# Altium schematic sheet SVPXFMC_Carrier_3U.SchDoc: SVPXFMC Carrier 3U
size 420 x 297 mm; CheckedBy: \; Author: G.Kasprowicz; CompanyName: ISE; DrawnBy: T.Przywozki; Organization: WUT ISE; Address1: Warsaw University of Technology; Address2: Nowowiejska 15/19 00-665 Warsaw; Revision: 1.0.; SheetNumber: 1; SheetTotal: 20; ModifiedBy: -; CheckedDate: -; Title2: Top; DivGrp: ISE; Designer: G.Kasprowicz; Project: SVPXFMC Carrier 3U; ModifiedDate: -; ProjectName: FMC SFP 4
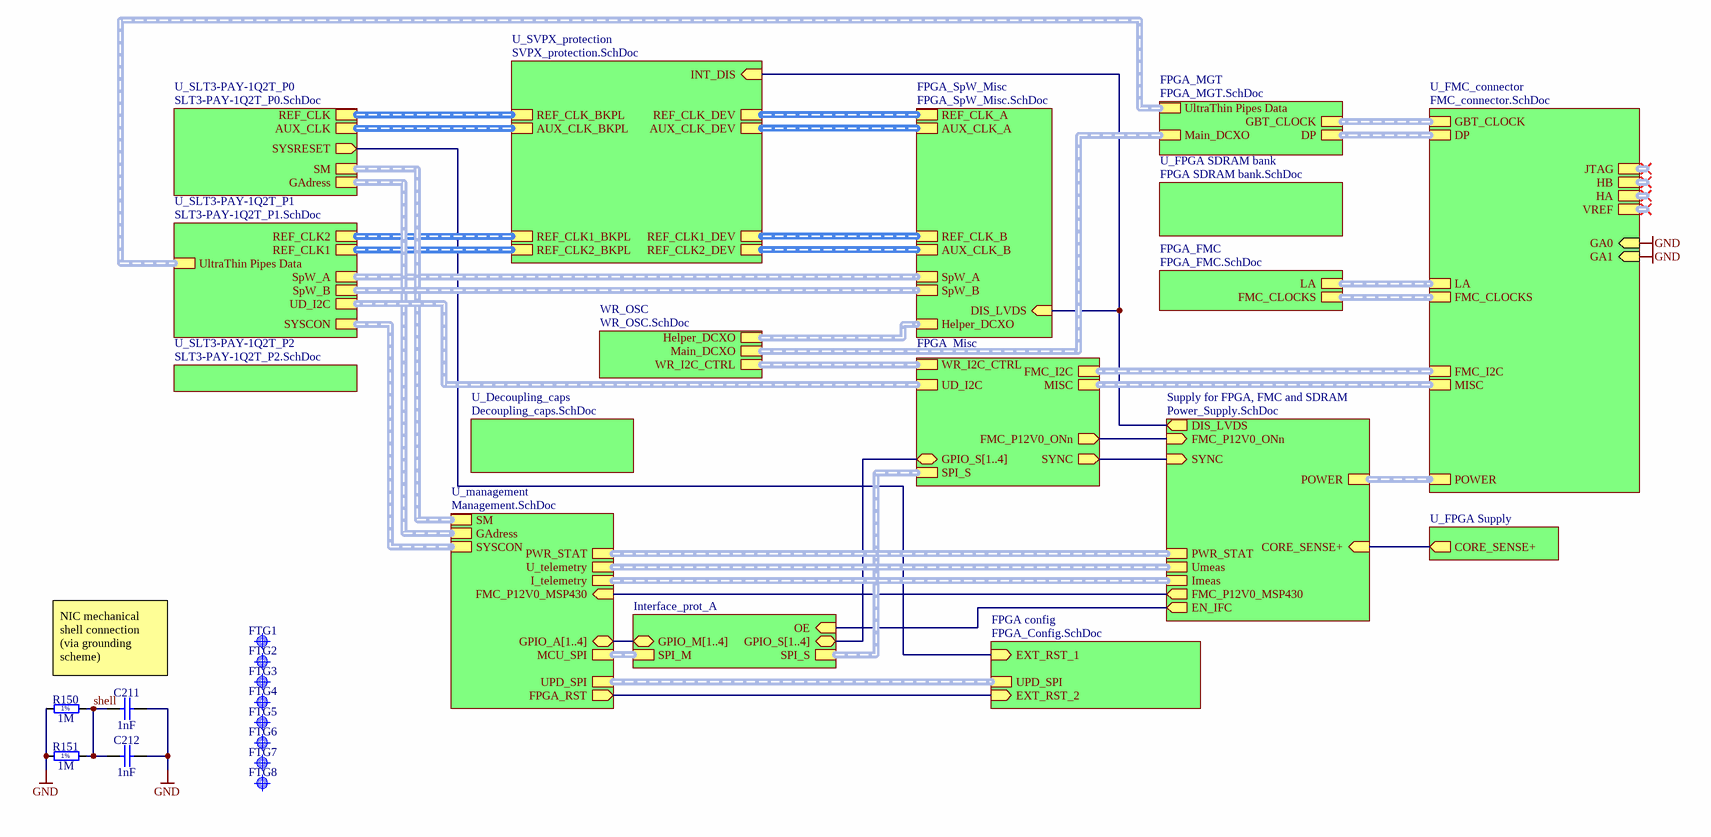
[diagram p0: SVPXFMC_Carrier_3U.SchDoc]

## Parts
C211  1nF  [CAPC1005X55N]
C212  1nF  [CAPC1005X55N]
FTG1  Use only in PCB  [FIDUCIAL_TOP_C100-200]  (value not drawn)
FTG2  Use only in PCB  [FIDUCIAL_TOP_C100-200]  (value not drawn)
FTG3  Use only in PCB  [FIDUCIAL_TOP_C100-200]  (value not drawn)
FTG4  Use only in PCB  [FIDUCIAL_TOP_C100-200]  (value not drawn)
FTG5  Use only in PCB  [FIDUCIAL_TOP_C100-200]  (value not drawn)
FTG6  Use only in PCB  [FIDUCIAL_TOP_C100-200]  (value not drawn)
FTG7  Use only in PCB  [FIDUCIAL_TOP_C100-200]  (value not drawn)
FTG8  Use only in PCB  [FIDUCIAL_TOP_C100-200]  (value not drawn)
R150  1M  [RESC1005X40N]
R151  1M  [RESC1005X40N]

## Sub-sheets
FPGA config = FPGA_Config.SchDoc: UPD_SPI (harness UPD_SPI), EXT_RST_1 (in), EXT_RST_2 (in)
FPGA_FMC = FPGA_FMC.SchDoc: LA (harness FMC_J1_LA), FMC_CLOCKS (harness FMC_CLOCKS)
FPGA_MGT = FPGA_MGT.SchDoc: GBT_CLOCK (harness GBT_CLOCK), DP (harness FMC_J1_DP), Main_DCXO (harness DIFF_CLK), UltraThin Pipes Data (harness UTP_Data)
FPGA_Misc = FPGA_Misc.SchDoc: SYNC (out), GPIO_S[1..4] (bidir), SPI_S (harness SPI), FMC_I2C (harness I2C), MISC (harness MISC), WR_I2C_CTRL (harness WR_I2C_CTRL), FMC_P12V0_ONn (out), UD_I2C (harness I2C)
FPGA_SpW_Misc = FPGA_SpW_Misc.SchDoc: SpW_B (harness SpW), SpW_A (harness SpW), REF_CLK_A (harness CLK), REF_CLK_B (harness CLK), DIS_LVDS (in), AUX_CLK_A (harness CLK), AUX_CLK_B (harness CLK), Helper_DCXO (harness DIFF_CLK)
Interface_prot_A = Interface_Protection.SchDoc: SPI_M (harness SPI), SPI_S (harness SPI), OE (in), GPIO_S[1..4] (bidir), GPIO_M[1..4] (bidir)
Supply for FPGA, FMC and SDRAM = Power_Supply.SchDoc: Imeas (harness Imeas), SYNC (in), POWER (harness FMC_POWER), CORE_SENSE+ (in), FMC_P12V0_ONn (in), PWR_STAT (harness PWR_STAT), Umeas (harness Umeas), DIS_LVDS (out), EN_IFC (out), FMC_P12V0_MSP430 (out)
U_Decoupling_caps = Decoupling_caps.SchDoc: no entries
U_FMC_connector = FMC_connector.SchDoc: DP (harness FMC_J1_DP), LA (harness FMC_J1_LA), HA (harness FMC_J1_HA), HB (harness FMC_J1_HB), MISC (harness MISC), POWER (harness FMC_POWER), JTAG (harness FMC_J1_JTAG), FMC_I2C (harness I2C), FMC_CLOCKS (harness FMC_CLOCKS), VREF (harness FMC_J1_VREF), GA0 (in), GA1 (in), GBT_CLOCK (harness GBT_CLOCK)
U_FPGA SDRAM bank = FPGA SDRAM bank.SchDoc: no entries
U_FPGA Supply = FPGA Supply.SchDoc: CORE_SENSE+ (out)
U_management = Management.SchDoc: MCU_SPI (harness SPI), SM (harness SM), GAdress (harness GAdress), U_telemetry (harness Umeas), I_telemetry (harness Imeas), FPGA_RST (out), UPD_SPI (harness UPD_SPI), SYSCON (harness SYSCON), PWR_STAT (harness PWR_STAT), GPIO_A[1..4] (bidir), FMC_P12V0_MSP430 (in)
U_SLT3-PAY-1Q2T_P0 = SLT3-PAY-1Q2T_P0.SchDoc: AUX_CLK (harness CLK), REF_CLK (harness CLK), GAdress (harness GAdress), SM (harness SM), SYSRESET (out)
U_SLT3-PAY-1Q2T_P1 = SLT3-PAY-1Q2T_P1.SchDoc: SpW_A (harness SpW), SpW_B (harness SpW), REF_CLK1 (harness CLK), REF_CLK2 (harness CLK), SYSCON (harness SYSCON), UD_I2C (harness I2C), UltraThin Pipes Data
U_SLT3-PAY-1Q2T_P2 = SLT3-PAY-1Q2T_P2.SchDoc: no entries
U_SVPX_protection = SVPX_protection.SchDoc: REF_CLK_BKPL (harness CLK), AUX_CLK_BKPL (harness CLK), AUX_CLK_DEV (harness CLK), REF_CLK_DEV (harness CLK), INT_DIS (in), REF_CLK1_BKPL (harness CLK), REF_CLK2_BKPL (harness CLK), REF_CLK1_DEV (harness CLK), REF_CLK2_DEV (harness CLK)
WR_OSC = WR_OSC.SchDoc: WR_I2C_CTRL (harness WR_I2C_CTRL), Main_DCXO (harness DIFF_CLK), Helper_DCXO (harness DIFF_CLK)

## Nets
GND: C211.2 C212.2 R150.1 R151.1 ; sheet U_FMC_connector/GA0, sheet U_FMC_connector/GA1
shell: C211.1 C212.1 R150.2 R151.2
(unnamed): sheet Interface_prot_A/OE, sheet Supply for FPGA, FMC and SDRAM/EN_IFC
(unnamed): sheet FPGA_Misc/SYNC, sheet Supply for FPGA, FMC and SDRAM/SYNC
(unnamed): sheet FPGA_Misc/FMC_P12V0_ONn, sheet Supply for FPGA, FMC and SDRAM/FMC_P12V0_ONn
(unnamed): sheet Supply for FPGA, FMC and SDRAM/CORE_SENSE+, sheet U_FPGA Supply/CORE_SENSE+
(unnamed): sheet Supply for FPGA, FMC and SDRAM/DIS_LVDS, sheet FPGA_SpW_Misc/DIS_LVDS, sheet U_SVPX_protection/INT_DIS
(unnamed): sheet Supply for FPGA, FMC and SDRAM/FMC_P12V0_MSP430, sheet U_management/FMC_P12V0_MSP430
(unnamed): sheet FPGA config/EXT_RST_1, sheet U_SLT3-PAY-1Q2T_P0/SYSRESET
(unnamed): sheet FPGA config/EXT_RST_2, sheet U_management/FPGA_RST

## Buses and harness runs
bus sheet FPGA_Misc/GPIO_S[1..4] = sheet Interface_prot_A/GPIO_S[1..4]
bus sheet Interface_prot_A/GPIO_M[1..4] = sheet U_management/GPIO_A[1..4]
harness sheet FPGA config/UPD_SPI = sheet U_management/UPD_SPI
harness sheet FPGA_FMC/FMC_CLOCKS = sheet U_FMC_connector/FMC_CLOCKS
harness sheet FPGA_FMC/LA = sheet U_FMC_connector/LA
harness sheet FPGA_MGT/DP = sheet U_FMC_connector/DP
harness sheet FPGA_MGT/GBT_CLOCK = sheet U_FMC_connector/GBT_CLOCK
harness sheet FPGA_MGT/Main_DCXO = sheet WR_OSC/Main_DCXO
harness sheet FPGA_MGT/UltraThin Pipes Data = sheet U_SLT3-PAY-1Q2T_P1/UltraThin Pipes Data
harness sheet FPGA_Misc/FMC_I2C = sheet U_FMC_connector/FMC_I2C
harness sheet FPGA_Misc/MISC = sheet U_FMC_connector/MISC
harness sheet FPGA_Misc/SPI_S = sheet Interface_prot_A/SPI_S
harness sheet FPGA_Misc/UD_I2C = sheet U_SLT3-PAY-1Q2T_P1/UD_I2C
harness sheet FPGA_Misc/WR_I2C_CTRL = sheet WR_OSC/WR_I2C_CTRL
harness sheet FPGA_SpW_Misc/AUX_CLK_A = sheet U_SVPX_protection/AUX_CLK_DEV
harness sheet FPGA_SpW_Misc/AUX_CLK_B = sheet U_SVPX_protection/REF_CLK2_DEV
harness sheet FPGA_SpW_Misc/Helper_DCXO = sheet WR_OSC/Helper_DCXO
harness sheet FPGA_SpW_Misc/REF_CLK_A = sheet U_SVPX_protection/REF_CLK_DEV
harness sheet FPGA_SpW_Misc/REF_CLK_B = sheet U_SVPX_protection/REF_CLK1_DEV
harness sheet FPGA_SpW_Misc/SpW_A = sheet U_SLT3-PAY-1Q2T_P1/SpW_A
harness sheet FPGA_SpW_Misc/SpW_B = sheet U_SLT3-PAY-1Q2T_P1/SpW_B
harness sheet Interface_prot_A/SPI_M = sheet U_management/MCU_SPI
harness sheet Supply for FPGA, FMC and SDRAM/Imeas = sheet U_management/I_telemetry
harness sheet Supply for FPGA, FMC and SDRAM/POWER = sheet U_FMC_connector/POWER
harness sheet Supply for FPGA, FMC and SDRAM/PWR_STAT = sheet U_management/PWR_STAT
harness sheet Supply for FPGA, FMC and SDRAM/Umeas = sheet U_management/U_telemetry
harness sheet U_management/GAdress = sheet U_SLT3-PAY-1Q2T_P0/GAdress
harness sheet U_management/SM = sheet U_SLT3-PAY-1Q2T_P0/SM
harness sheet U_management/SYSCON = sheet U_SLT3-PAY-1Q2T_P1/SYSCON
harness sheet U_SLT3-PAY-1Q2T_P0/AUX_CLK = sheet U_SVPX_protection/AUX_CLK_BKPL
harness sheet U_SLT3-PAY-1Q2T_P0/REF_CLK = sheet U_SVPX_protection/REF_CLK_BKPL
harness sheet U_SLT3-PAY-1Q2T_P1/REF_CLK1 = sheet U_SVPX_protection/REF_CLK2_BKPL
harness sheet U_SLT3-PAY-1Q2T_P1/REF_CLK2 = sheet U_SVPX_protection/REF_CLK1_BKPL

## Notes on the sheet
- NIC mechanical shell connection (via grounding scheme)
- Project/Equipment
- Document
- Designer
- Drawn by
- Check.by
- File
- Last Mod.
- Print Date
- Sheet
- Size
- A3
- of
- Rev
- Copyright WUT ISE 2019
  This documentation describes Open Hardware and is licensed under the CERN OHL v.1.1. You may redistribute and modify this documentation under the terms of the CERN OHL v1.1.
  (http://ohwr.org/CERNOHL). This documentation is dristributed WITHOUT ANY EXPRESS OR IMPLIED WARRANTY, INCLUDING OF MERCHANTABILITY, SATISFACTORY QUALITY AND FITNESS FOR A PARTICULAR PURPOSE. Please see the CERN OHL v.1.1 for applicable conditions
- (in symbol R0402_1M_1%_0.0625W_100PPM) 1%

## Library data of the parts
C211 C212 = CC0402_1NF_50V_10%_X7R: Non-polarised capacitor; Part Description: SMD Multilayer Chip Ceramic Capacitor; Manufacturer: GENERIC; Manufacturer1 Part Number: 223858715623; Voltage: 50V; TC: X7R; Tolerance: ±10%; Part Number: CC0402_1NF_50V_10%_X7R; Component Kind: Standard; Component Type: Standard; Pin Count: 2; Value: 1nF; Status: Not Recommended; Manufacturer Part Number: CC0402_1NF_50V_10%_X7R; Case: 0402; Mounted: Yes; Socket: No; SMD: Yes; Sense: No; Manufacturer1 Example: PHYCOMP; Manufacturer1 ComponentHeight: 0.55mm; HelpURL: \\cern.ch\dfs\Applications\Altium\Datasheets\CC0402_X7R_PHYCOMP.pdf; Author: CERN DEM JLC; CreateDate: 03.12.2007; LatestRevisionDate: 03.12.2007
FTG1-FTG8 = FIDUCIAL_TARGET_C100-200: Fiducial Target; Part Description: Round Fiducial Target, Top Layer, 1.0mm, Top Solder 2.0mm, Keepout =2.0mm; Mounted: No; Part Number: FIDUCIAL_TARGET_C100-200; Component Kind: Standard (No BOM); Component Type: Standard (No BOM); Pin Count: 1; Family: Fiducial; Socket: No; SMD: Yes; Sense: No; Status: None; ComponentHeight: 0mm; HelpURL: Undefined; Author: CERN DEM JLC; CreateDate: 09.02.2010; LatestRevisionDate: 04.04.2012; PackageDescription: Round Fiducial Target, Top Layer, 1.0mm, Top Solder 2.0mm, Keepout =2.0mm
R150 R151 = R0402_1M_1%_0.0625W_100PPM: Resistor - 1%; Part Description: General Purpose Thick Film Chip Resistor; Manufacturer: GENERIC; Manufacturer1 Part Number: 232270671005L; TC: ±100ppm/°C; PressFit: No; Part Number: R0402_1M_1%_0.0625W_100PPM; Component Kind: Standard; Component Type: Standard; Pin Count: 2; Value: 1M; Status: Not Recommended; Power: 0.0625W; Tolerance: ±1%; Manufacturer Part Number: R0402_1M_1%_0.0625W_100PPM; Case: 0402; Mounted: Yes; Sense: No; Socket: No; SMD: Yes; Manufacturer1 Example: YAGEO PHYCOMP; Manufacturer1 ComponentHeight: 0.4mm; HelpURL: \\cern.ch\dfs\Applications\Altium\Datasheets\R0402_Phycomp_RC0402.pdf; Author: CERN DEM JLC; CreateDate: 03.12.2007; LatestRevisionDate: 17.10.2012